# EAGLE design 34063 (EAGLE 7.2.0)
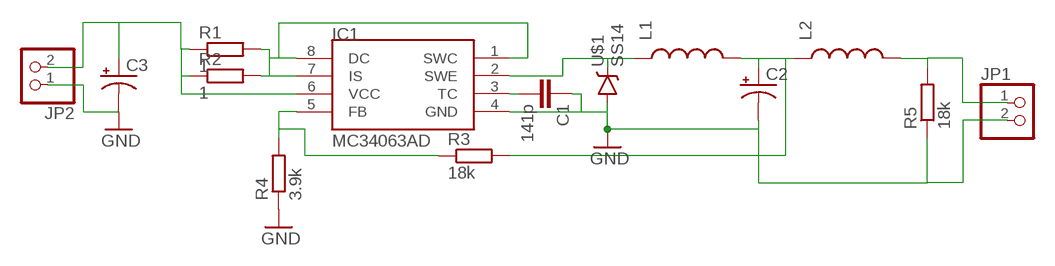
[diagram p0: schematic, sheet 1]

## Parts
C1  141p  CC0603  [C0603]
C2  CAP_POLE  [PANASONIC_E]
C3  CAP_POLE  [PANASONIC_E]
IC1  MC34063AD  [SOIC8]
JP1  PINHD-1X02_2.54  [1X02]
JP2  PINHD-1X02_2.54  [1X02]
L1  INDUCTORSRU1038  [SRU1038]
L2  INDUCTORVLF4012A  [VLF4012A]
R1  1  R0805  [R0805]
R2  1  R0805  [R0805]
R3  18k  R0805  [R0805]
R4  3.9k  R0805  [R0805]
R5  18k  R0805  [R0805]
U$1  SS14  [SMA-DIODE]

## Nets
GND: C1.1 C2.- C3.- IC1.4(GND) JP1.2 JP2.1 R4.1 R5.1 U$1.A
N$1: C3.+ IC1.6(VCC) JP2.2 R1.1 R2.1
N$2: IC1.2(SWE) L1.1 U$1.C
N$3: IC1.1(SWC) IC1.7(IS) IC1.8(DC) R1.2 R2.2
N$4: C2.+ L1.2 L2.P$1 R3.2
N$6: C1.2 IC1.3(TC)
N$7: JP1.1 L2.P$2 R5.2
N$8: IC1.5(FB) R3.1 R4.2

## Library data of the parts
C1 = CasaLibrary:C: Capacitor
C2 C3 = SparkFun-Passives:CAP_POL: Capacitor Polarized These are standard SMD and PTH capacitors. Normally 10uF, 47uF, and 100uF in electrolytic and tantalum varieties. Always verify the external diameter of the through hole cap, it varies with capacity, voltage, and manufacturer. The EIA devices should be standard.
IC1 = CasaLibrary:MC34063
JP1 JP2 = pinhead-2:PINHD-1X02: PIN HEADER
L1 L2 = SparkFun-Passives:INDUCTOR: Inductors Basic Inductor/Choke - 0603 and 1206. Footprints are not proven and vary greatly between part numbers. INDUCTOR POWER 3.3UH 4.0A SMD 0.197" L x 0.197" W x 0.177" H (5.00mm x 5.00mm x 4.50mm)
R1-R5 = CasaLibrary:R
U$1 = CasaLibrary:SS14

## Board
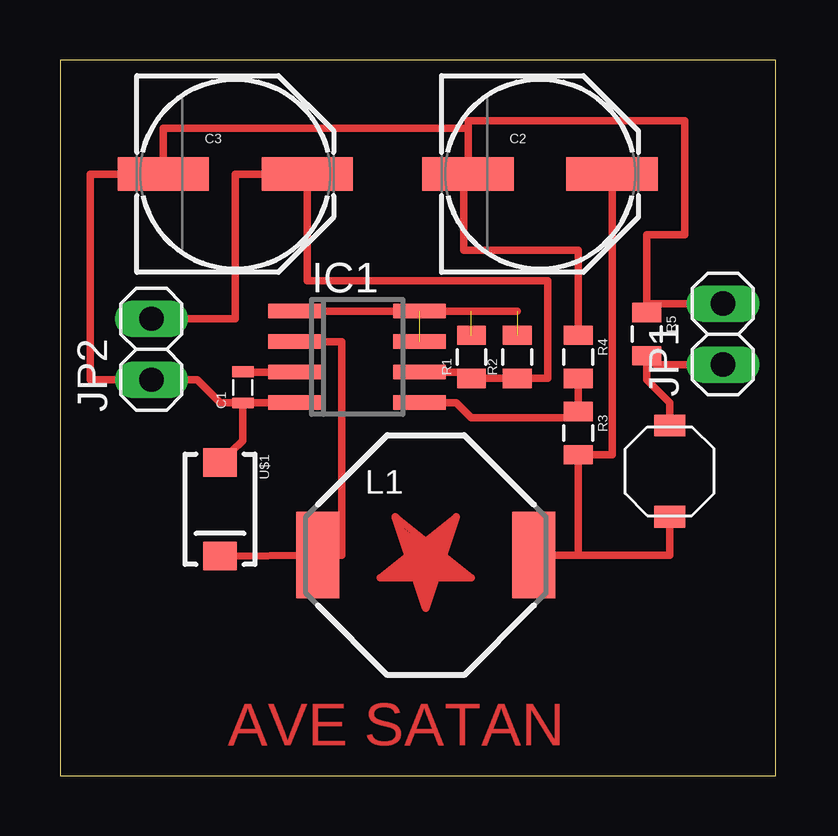
[diagram p1: board, top side]

Size 29.82 x 29.83 mm. Coordinates in mm from the lower left corner, seen from the top.
Outline: 0,0 29.82,0 29.82,29.83 0,29.83 0,0
Copper layers (1*16): Top 0.035mm / dielectric 1.5mm / Bottom 0.035mm
Design rules "default": minimum track width 0.2mm, minimum drill 0.2mm, track to track 0.2mm, track to pad 0.2mm, pad to pad 0.2mm, via to via 0.2mm, smd to smd 0.2mm, copper to edge 0.2mm, drill to drill 0.2mm, minimum pad ring 10mil, minimum via ring 8mil, stop-mask expansion 4mil, vias tented up to drill 0mil, thermal gap 10mil

### Footprints (pad centres in the part's own frame; a part is rotated, then mirrored left to right if it is on the bottom)
C0603 = smd 0.45 x 0.9: 1 -0.65,0; 2 0.65,0
PANASONIC_E = smd 3.8 x 1.4: + 3,0; - -3,0
SOIC8 = smd 0.6 x 2.2: 1 -1.905,-2.6; 2 -0.635,-2.6; 3 0.635,-2.6; 4 1.905,-2.6; 5 1.905,2.6; 6 0.635,2.6; 7 -0.635,2.6; 8 -1.905,2.6
1X02 = drill 1.016 long: 1 -1.27,0; 2 1.27,0
SRU1038 = smd 1.8 x 3.6: 1 -4.5,0; 2 4.5,0
VLF4012A = smd 0.9 x 1.3: P$1 -1.9,0; P$2 1.9,0
R0805 = smd 0.8 x 1.2: 1 -0.9,0; 2 0.9,0
SMA-DIODE = smd 1.2 x 1.4: A -1.95,0; C 1.95,0

### Placement (x,y rotation side)
C1  7.62,16.19 90 top
C2  20,25.08 0 top
C3  7.3,25.08 0 top
IC1  12.38,17.46 270 top
JP1  27.62,18.41 90 top
JP2  3.81,17.78 90 top
L1  15.24,9.21 0 top
L2  25.4,12.7 90 top
R1  17.14,17.46 90 top
R2  19.05,17.46 90 top
R3  21.59,14.29 270 top
R4  21.59,17.46 270 top
R5  24.45,18.41 270 top
U$1  6.67,11.11 270 top

### Tracks (layer width: path | path; a pad name or v marks a point on that pad's centre or on a via)
GND
  Top 0.305: C1.1 7.61,15.56 6.67,15.56 5.71,16.51 JP2.1 1.27,16.51 1.27,25.08 C3.- 4.3,26.99 17,26.99 | C1.1 9.77,15.54 IC1.4 | U$1.A 7.62,13.97 C1.1 | 17,26.99 C2.- 16.83,25.08 16.83,21.91 21.59,21.91 R4.1 | JP1.2 24.45,19.69 R5.1 24.45,22.54 26.04,22.54 26.04,27.31 17,27.31 17,26.99
N$1
  Top 0.305: JP2.2 7.3,19.05 7.3,25.08 C3.+ 10.3,20.64 20.32,20.64 20.32,16.56 R2.1 R1.1 17.46,16.83 IC1.6
N$2
  Top 0.305: U$1.C L1.1 11.75,9.21 11.75,18.1 IC1.2
N$3  (3 unrouted)
  Top 0.305: 19.05,19.37 17.14,19.37 IC1.8 IC1.1
N$4
  Top 0.305: C2.+ 23,13.39 R3.2 21.59,9.21 L1.2 25.4,9.21 L2.P$1
N$5
  Top 0.305: 13.97,10.79 15.24,6.98 16.51,10.79 13.34,8.26 13.65,8.26 | 13.65,8.26 15.24,8.26 | 15.24,8.26 15.88,8.26 | 15.88,8.26 16.19,8.26 | 16.19,8.26 16.83,8.26 | 16.83,8.26 17.14,8.26 15.56,9.53 | 15.56,9.53 13.97,10.79 | 13.97,10.79 15.24,7.62 16.19,10.16 | 16.19,10.16 15.88,9.53 | 15.88,9.53 15.24,8.26 | 15.24,8.26 14.92,8.89 | 14.92,8.89 14.29,10.16 15.56,9.21 | 15.56,9.21 15.24,8.57 14.61,9.84 15.24,8.89 15.56,9.21 | 15.56,9.21 15.24,9.21 15.24,7.94 16.19,10.16 | 16.19,10.16 15.56,9.84 15.88,9.53 | 15.88,9.53 15.88,8.26 | 15.88,8.26 16.19,8.89 16.83,8.26 | 16.83,8.26 16.19,8.57 16.19,8.26 | 16.19,8.26 13.97,8.57 14.29,8.89 14.61,8.57 13.65,8.26 | 13.65,8.26 14.92,8.89 | 15.56,9.53 16.19,10.48
N$6
  Top 0.305: IC1.3 7.63,16.83 C1.2
N$7
  Top 0.305: L2.P$2 25.4,15.56 24.45,16.51 R5.2 24.82,17.14 JP1.1
N$8
  Top 0.305: R4.2 R3.1 21.32,14.92 17.14,14.92 16.51,15.56 IC1.5

### Text on the board
Top: AVE SATAN